# EAGLE design fl5 fl9 modv1 (EAGLE 6.1)
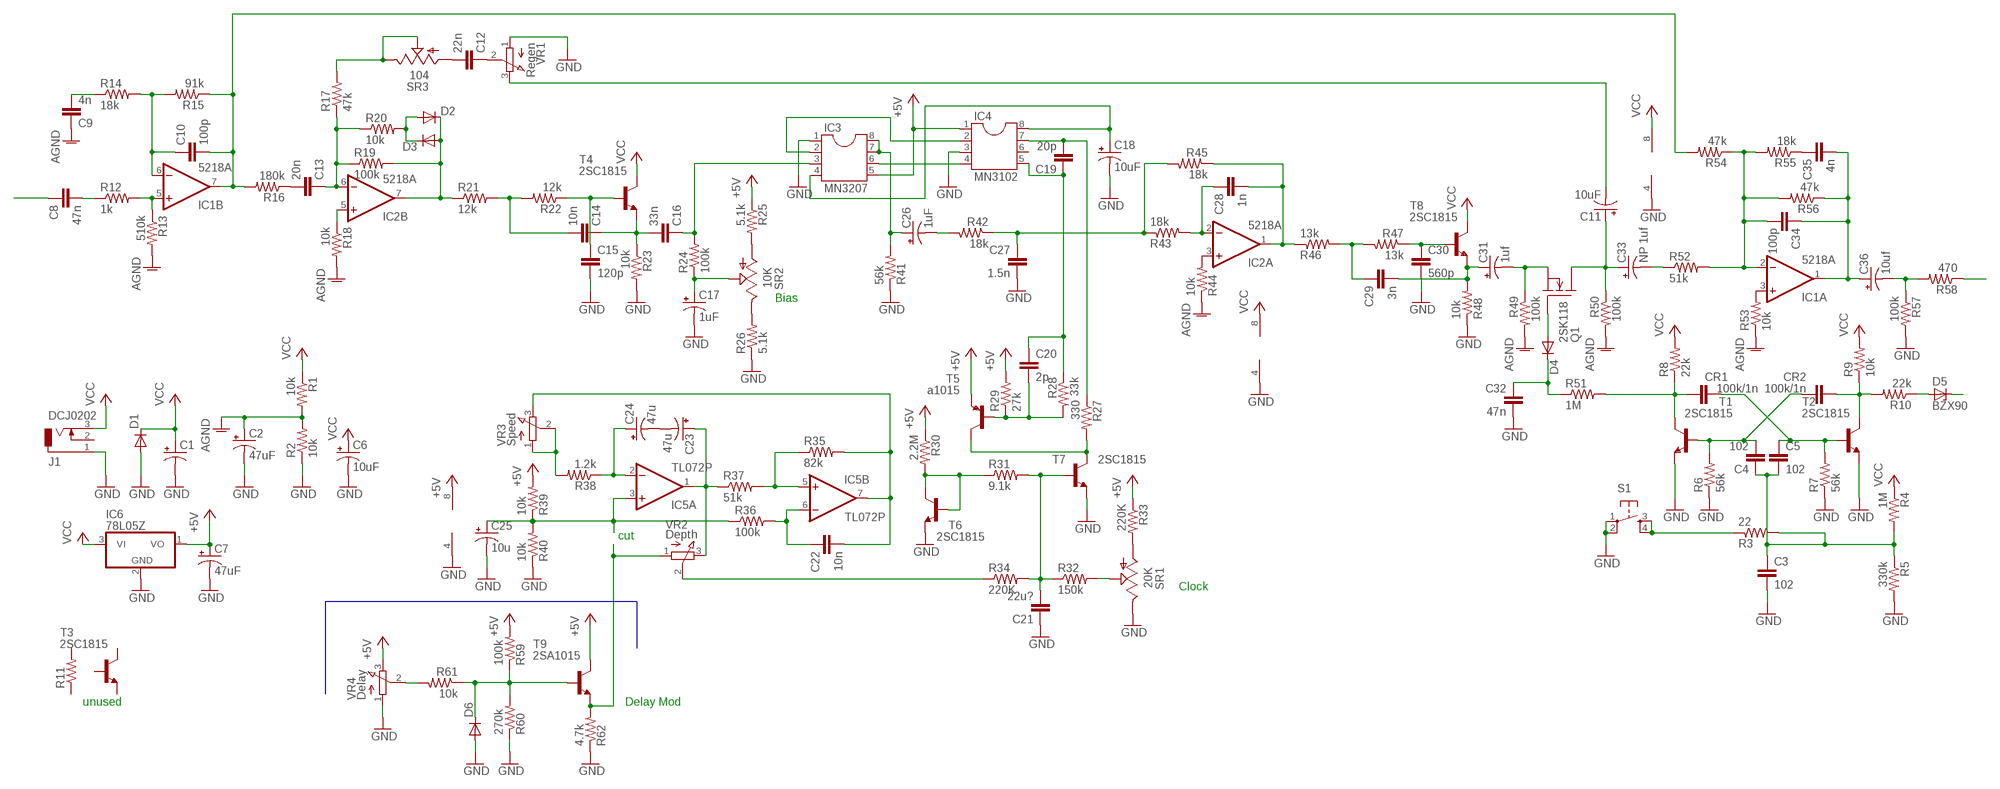
[diagram p0: schematic, sheet 1]

## Parts
C1  CPOL-USE3.5-8  [E3,5-8]
C2  47uF  CPOL-USE1.8-4  [E1,8-4]
C3  102  C-EU025-024X044  [C025-024X044]
C4  102  C-EU025-024X044  [C025-024X044]
C5  102  C-EU025-024X044  [C025-024X044]
C6  10uF  CPOL-USE1.8-4  [E1,8-4]
C7  47uF  CPOL-USE1.8-4  [E1,8-4]
C8  47n  C-EU050-025X075  [C050-025X075]
C9  4n  C-EU050-025X075  [C050-025X075]
C10  100p  C-EU025-024X044  [C025-024X044]
C11  10uF  CPOL-USE1.8-4  [E1,8-4]
C12  22n  C-EU050-025X075  [C050-025X075]
C13  20n  C-EU050-025X075  [C050-025X075]
C14  10n  C-EU050-025X075  [C050-025X075]
C15  120p  C-EU050-024X044  [C050-024X044]
C16  33n  C-EU050-025X075  [C050-025X075]
C17  1uF  CPOL-USE1.8-4  [E1,8-4]
C18  10uF  CPOL-USE1.8-4  [E1,8-4]
C19  20p  C-EU025-024X044  [C025-024X044]
C20  2p  C-EU025-024X044  [C025-024X044]
C21  22u?  C-EU025-024X044  [C025-024X044]
C22  10n  C-EU050-025X075  [C050-025X075]
C23  47u  CPOL-USE2.5-7  [E2,5-7]
C24  47u  CPOL-USE2.5-7  [E2,5-7]
C25  10u  CPOL-USE1.8-4  [E1,8-4]
C26  1uF  CPOL-USE1.8-4  [E1,8-4]
C27  1.5n  C-EU050-025X075  [C050-025X075]
C28  1n  C-EU050-025X075  [C050-025X075]
C29  3n  C-EU050-025X075  [C050-025X075]
C30  560p  C-EU050-024X044  [C050-024X044]
C31  1uf  CPOL-USE1.8-4  [E1,8-4]
C32  47n  C-EU050-025X075  [C050-025X075]
C33  NP 1uf  CPOL-USE1.8-4  [E1,8-4]
C34  100p  C-EU025-024X044  [C025-024X044]
C35  4n  C-EU050-025X075  [C050-025X075]
C36  10uf  CPOL-USE1.8-4  [E1,8-4]
CR1  100k/1n  C-EU025-024X044  [C025-024X044]
CR2  100k/1n  C-EU025-024X044  [C025-024X044]
D1  DIODE-C1702-05  [C1702-05]
D2  DIODE-D-5  [D-5]
D3  DIODE-D-5  [D-5]
D4  DIODE-D-5  [D-5]
D5  BZX90  [DO34Z7]
D6  DIODE-D-5  [D-5]
IC1  5218A  LM4558N  [DIL08]
IC2  5218A  LM4558N  [DIL08]
IC3  MN3207  DIL8  [DIL08]
IC4  MN3102  DIL8  [DIL08]
IC5  TL072P  [DIL08]
IC6  78L05Z  [TO92]
J1  DCJ0202  [DCJ0202]
Q1  2SK118  VN2222KM  [TO237]
R1  10k  R-US_0204/5  [0204/5]
R2  10k  R-US_0204/5  [0204/5]
R3  22  R-US_0204/5  [0204/5]
R4  1M  R-US_0204/5  [0204/5]
R5  330k  R-US_0204/5  [0204/5]
R6  56k  R-US_0204/5  [0204/5]
R7  56k  R-US_0204/5  [0204/5]
R8  22k  R-US_0204/5  [0204/5]
R9  10k  R-US_0204/5  [0204/5]
R10  22k  R-US_0204/5  [0204/5]
R11  R-US_0204/5  [0204/5]
R12  1k  R-US_0204/5  [0204/5]
R13  510k  R-US_0204/5  [0204/5]
R14  18k  R-US_0204/5  [0204/5]
R15  91k  R-US_0204/5  [0204/5]
R16  180k  R-US_0204/5  [0204/5]
R17  47k  R-US_0204/5  [0204/5]
R18  10k  R-US_0204/5  [0204/5]
R19  100k  R-US_0204/5  [0204/5]
R20  10k  R-US_0204/5  [0204/5]
R21  12k  R-US_0204/5  [0204/5]
R22  12k  R-US_0204/5  [0204/5]
R23  10k  R-US_0204/5  [0204/5]
R24  100k  R-US_0204/5  [0204/5]
R25  5.1k  R-US_0204/5  [0204/5]
R26  5.1k  R-US_0204/5  [0204/5]
R27  330  R-US_0204/5  [0204/5]
R28  33k  R-US_0204/5  [0204/5]
R29  27k  R-US_0204/5  [0204/5]
R30  2.2M  R-US_0204/5  [0204/5]
R31  9.1k  R-US_0204/5  [0204/5]
R32  150k  R-US_0204/5  [0204/5]
R33  220K  R-US_0204/5  [0204/5]
R34  220K  R-US_0204/5  [0204/5]
R35  82k  R-US_0204/5  [0204/5]
R36  100k  R-US_0204/5  [0204/5]
R37  51k  R-US_0204/5  [0204/5]
R38  1.2k  R-US_0204/5  [0204/5]
R39  10k  R-US_0204/5  [0204/5]
R40  10k  R-US_0204/5  [0204/5]
R41  56k  R-US_0204/5  [0204/5]
R42  18k  R-US_0204/5  [0204/5]
R43  18k  R-US_0204/5  [0204/5]
R44  10k  R-US_0204/5  [0204/5]
R45  18k  R-US_0204/5  [0204/5]
R46  13k  R-US_0204/5  [0204/5]
R47  13k  R-US_0204/5  [0204/5]
R48  10k  R-US_0204/5  [0204/5]
R49  100k  R-US_0204/5  [0204/5]
R50  100k  R-US_0204/5  [0204/5]
R51  1M  R-US_0204/5  [0204/5]
R52  51k  R-US_0204/5  [0204/5]
R53  10k  R-US_0204/5  [0204/5]
R54  47k  R-US_0204/5  [0204/5]
R55  18k  R-US_0204/5  [0204/5]
R56  47k  R-US_0204/5  [0204/5]
R57  100k  R-US_0204/5  [0204/5]
R58  470  R-US_0204/5  [0204/5]
R59  100k  R-US_0204/5  [0204/5]
R60  270k  R-US_0204/5  [0204/5]
R61  10k  R-US_0204/5  [0204/5]
R62  4.7k  R-US_0204/5  [0204/5]
S1  TAC_SWITCHPTH  [TACTILE-PTH]
SR1  20K  TRIM_US-CA6V  [CA6V]
SR2  10K  TRIM_US-CA6V  [CA6V]
SR3  104  TRIM_US-CA6V  [CA6V]
T1  2SC1815  [TO92-ECB]
T2  2SC1815  [TO92-ECB]
T3  2SC1815  [TO92-ECB]
T4  2SC1815  [TO92-ECB]
T5  a1015  -PNP-TO92-ECB  [TO92-ECB]
T6  2SC1815  [TO92-ECB]
T7  2SC1815  [TO92-ECB]
T8  2SC1815  [TO92-ECB]
T9  2SA1015  2SC1815  [TO92-ECB]
VR1  Regen  EVUF2A  [EVUF]
VR2  Depth  EVUF2A  [EVUF]
VR3  Speed  EVUF2A  [EVUF]
VR4  Delay  EVUF2A  [EVUF]

## Nets
+5V: C7.+ IC3.5 IC4.1 IC5.8(P:V+) IC6.1(VO) R25.1 R29.2 R30.1 R33.1 R39.2 R59.2 T5.E T9.C VR4.3(E)
AGND: C2.+ C9.1 R1.2 R2.2 R13.2 R18.2 R44.1 R49.2 R50.2 R53.1
GND: C1.- C2.- C3.2 C6.- C7.- C15.2 C17.- C18.- C21.1 C25.- C27.2 C30.2 C32.2 D1.A D6.A IC1.4(P:V-) IC2.4(P:V-) IC3.1 IC4.3 IC5.4(P:V-) IC6.2(GND) J1.1 R2.1 R5.2 R6.1 R7.1 R23.2 R26.1 R40.1 R41.1 R48.1 R57.2 R60.1 R62.1 S1.1 S1.2 SR1.E T1.E T2.E T6.E T7.E VR1.1(A) VR4.1(A)
N$1: CR2.1 R9.1 R10.2 T2.C
N$2: C5.1 CR1.1 R7.2 T2.B
N$3: IC1.5(B:+IN) R12.2 R13.1
N$4: C10.2 IC1.7(B:OUT) R15.1 R16.2 R54.2
N$5: C10.1 IC1.6(B:-IN) R14.2 R15.2
N$6: D2.A D3.C R20.2
N$7: D2.C D3.A IC2.7(B:OUT) R19.2 R21.1
N$8: C13.1 IC2.6(B:-IN) R17.1 R19.1 R20.1
N$9: C15.1 R22.1 T4.B
N$10: C3.1 C4.1 C5.2 R3.2 R4.2 R5.1
N$11: R3.1 S1.3 S1.4
N$12: R27.2 T5.C T7.C
N$13: C4.2 CR2.2 R6.2 T1.B
N$14: C12.1 VR1.2(S)
N$15: IC2.5(B:+IN) R18.1
N$16: R30.2 R31.1 T6.B T6.C
N$17: R34.1 VR2.2(S)
N$18: IC2.3(A:+IN) R44.2
N$19: C21.2 R31.2 R32.1 R34.2 T7.B
N$20: C8.2 R12.1
N$21: R32.2 SR1.S
N$22: C12.2 SR3.A
N$23: R33.2 SR1.A
N$24: C20.2 R28.2 R29.1 T5.B
N$25: C23.+ IC5.1(A:OUT) R37.1 VR2.3(E)
N$26: C25.+ IC5.3(A:+IN) R36.1 R39.1 R40.2
N$27: R38.2 VR3.1(A) VR3.2(S)
N$28: C24.+ IC5.2(A:-IN) R38.1
N$29: C22.2 IC5.7(B:OUT) R35.2 VR3.3(E)
N$30: IC5.5(B:+IN) R35.1 R37.2
N$31: C22.1 IC5.6(B:-IN) R36.2
N$32: C28.1 IC2.2(A:-IN) R43.2
N$33: C28.2 IC2.1(A:OUT) R45.1 R46.1
N$34: C29.1 R46.2 R47.2
N$35: R17.2 SR3.E SR3.S
N$36: C13.2 R16.1
N$37: C14.2 R21.2 R22.2
N$38: C14.1 C16.2 R23.1 T4.E
N$39: C9.2 R14.1
N$40: R26.2 SR2.E
N$41: R25.2 SR2.A
N$42: CR1.2 R8.1 R51.2 T1.C
N$43: C32.1 D4.C R51.1
N$44: C17.+ R24.1 SR2.S
N$45: C18.+ IC3.4 IC4.8
N$46: C26.+ IC3.7 IC3.8 R41.2
N$47: C16.1 IC3.3 R24.2
N$48: IC3.2 IC4.2
N$49: C8.1
N$50: IC3.6 IC4.4
N$51: C19.2 IC4.7 R27.1
N$52: C19.1 C20.1 IC4.5 R28.1
N$53: C23.- C24.-
N$54: C26.- R42.2
N$55: C27.1 R42.1 R43.1 R45.2
N$56: C11.+ C33.+ Q1.1(D) R50.1
N$57: C29.2 C31.+ R48.2 T8.E
N$58: C36.- R57.1 R58.2
N$59: C30.1 R47.1 T8.B
N$60: D4.A Q1.2(G)
N$61: C33.- R52.1
N$62: C11.- VR1.3(E)
N$63: C31.- Q1.3(S) R49.1
N$64: C34.1 C35.2 C36.+ IC1.1(A:OUT) R56.1
N$65: IC1.3(A:+IN) R53.2
N$66: C34.2 IC1.2(A:-IN) R52.2 R54.1 R55.2 R56.2
N$67: C35.1 R55.1
N$68: D5.A R10.1
N$69: R58.1
N$70: D5.C
N$71: R62.2 T9.E VR2.1(A)
N$72: D6.C R59.1 R60.2 R61.1 T9.B
N$74: R61.2 VR4.2(S)
VCC: C1.+ C6.+ D1.C IC1.8(P:V+) IC2.8(P:V+) IC6.3(VI) J1.3 R1.1 R4.1 R8.2 R9.2 T4.C T8.C
Unconnected: IC4.6 J1.2 R11.1 R11.2 T3.B T3.C T3.E

## Buses
B$1

## Notes on the sheet
- Bias
- cut
- Clock
- unused | Delay Mod

## Library data of the parts
C1 C2 C6 C7 C11 C17 C18 C23-C26 C31 C33 C36 = rcl:CPOL-US: POLARIZED CAPACITOR, American symbol
C3-C5 C8-C10 C12-C16 C19-C22 C27-C30 C32 C34 C35 CR1 CR2 = rcl:C-EU: CAPACITOR, European symbol
D1-D4 D6 = diode:DIODE-: DIODE
D5 = diode:BZX90: Z DIODE
IC1 IC2 = linear:*4558: OP AMP
IC3 IC4 = ic-package:DIL8: Dual In Line / Socket
IC5 = linear:TL072: OP AMP
IC6 = linear:78*: Positive VOLTAGE REGULATOR Source: http://cache.national.com/ds/LM/LM78L05.pdf http://www.fairchildsemi.com/ds/LM/LM7805.pdf
J1 = con-jack:DCJ0202: DC POWER JACK Source: DCJ0202.pdf; OC_FARNELL: unknown; OC_NEWARK: unknown
Q1 = transistor-fet:VN2222KM: N-Channel Enhancement MOSFET (VMOS); 60V; 0,5A; 7,5Ohm
R1-R62 = rcl:R-US_: RESISTOR, American symbol
S1 = SparkFun:TAC_SWITCH: Momentary Switch Button commonly used for reset or general input. Spark Fun Electronics SKU : COM-00097
SR1-SR3 = pot:TRIM_US-: POTENTIOMETER
T1-T4 T6-T9 = transistor:2SC1815: NPN EPITAXIAL TRANSISTOR Source: TOSHIBA .. 2SC1815 1.pdf
T5 = transistor-neu-to92:*-PNP-: PNP Transistror
VR1-VR4 = pot:EVU: 9 mm Square Rotary Potentiometers Source: Panasonic

## Board
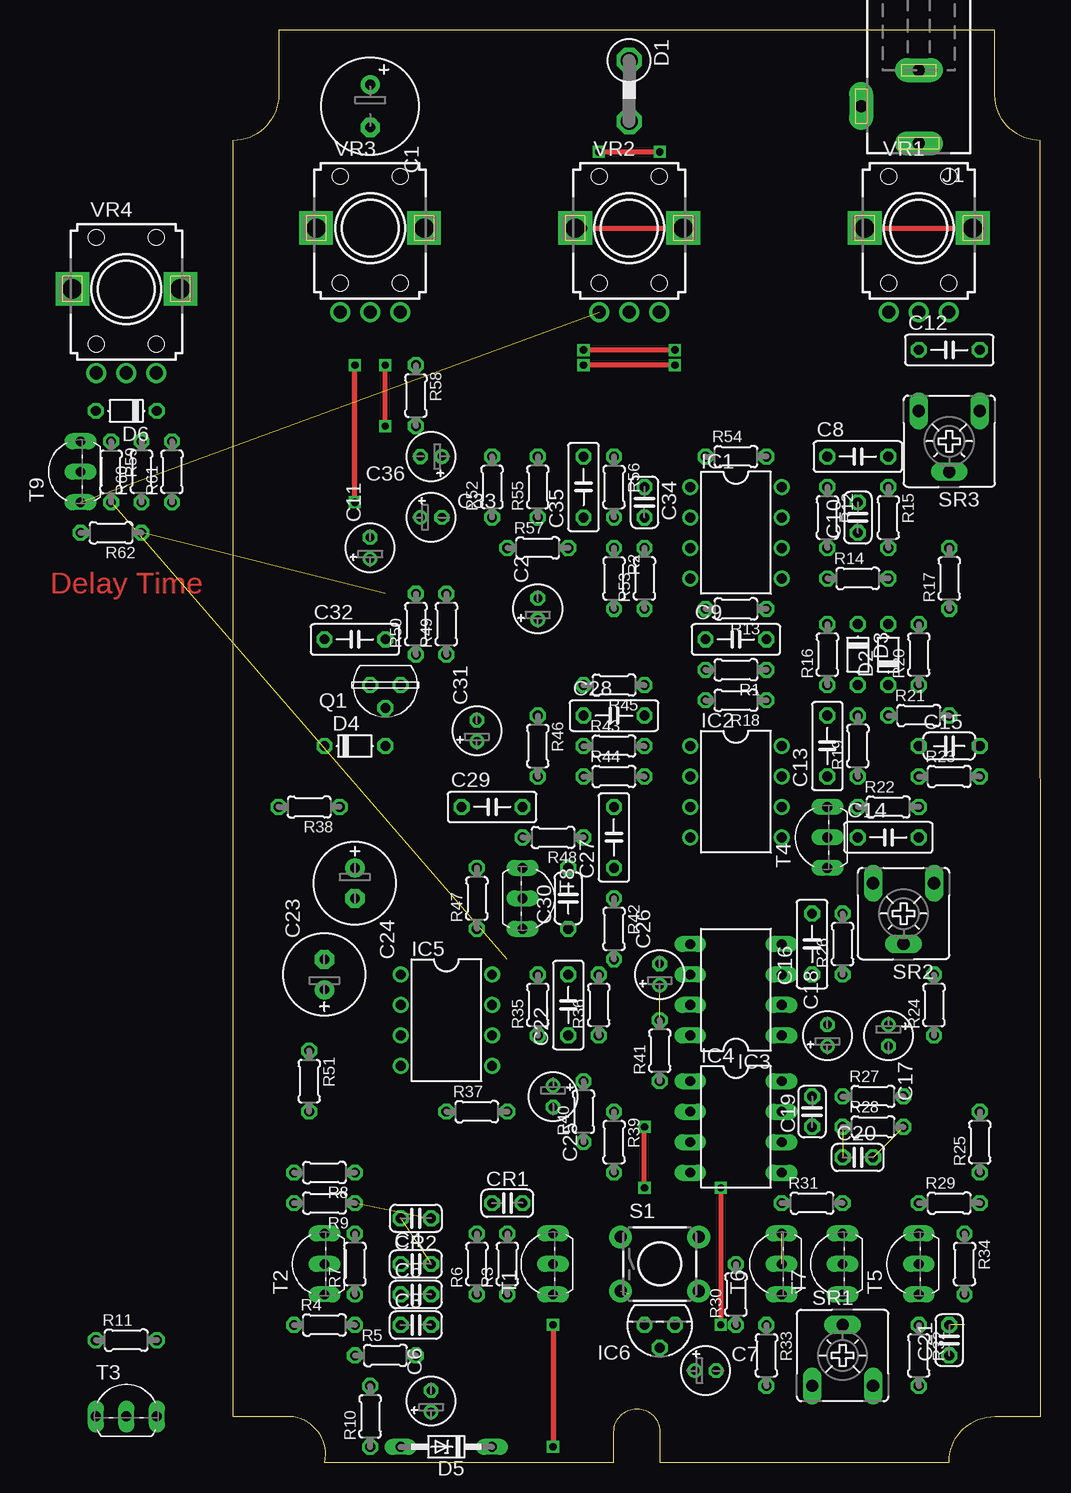
[diagram p1: board, top side]
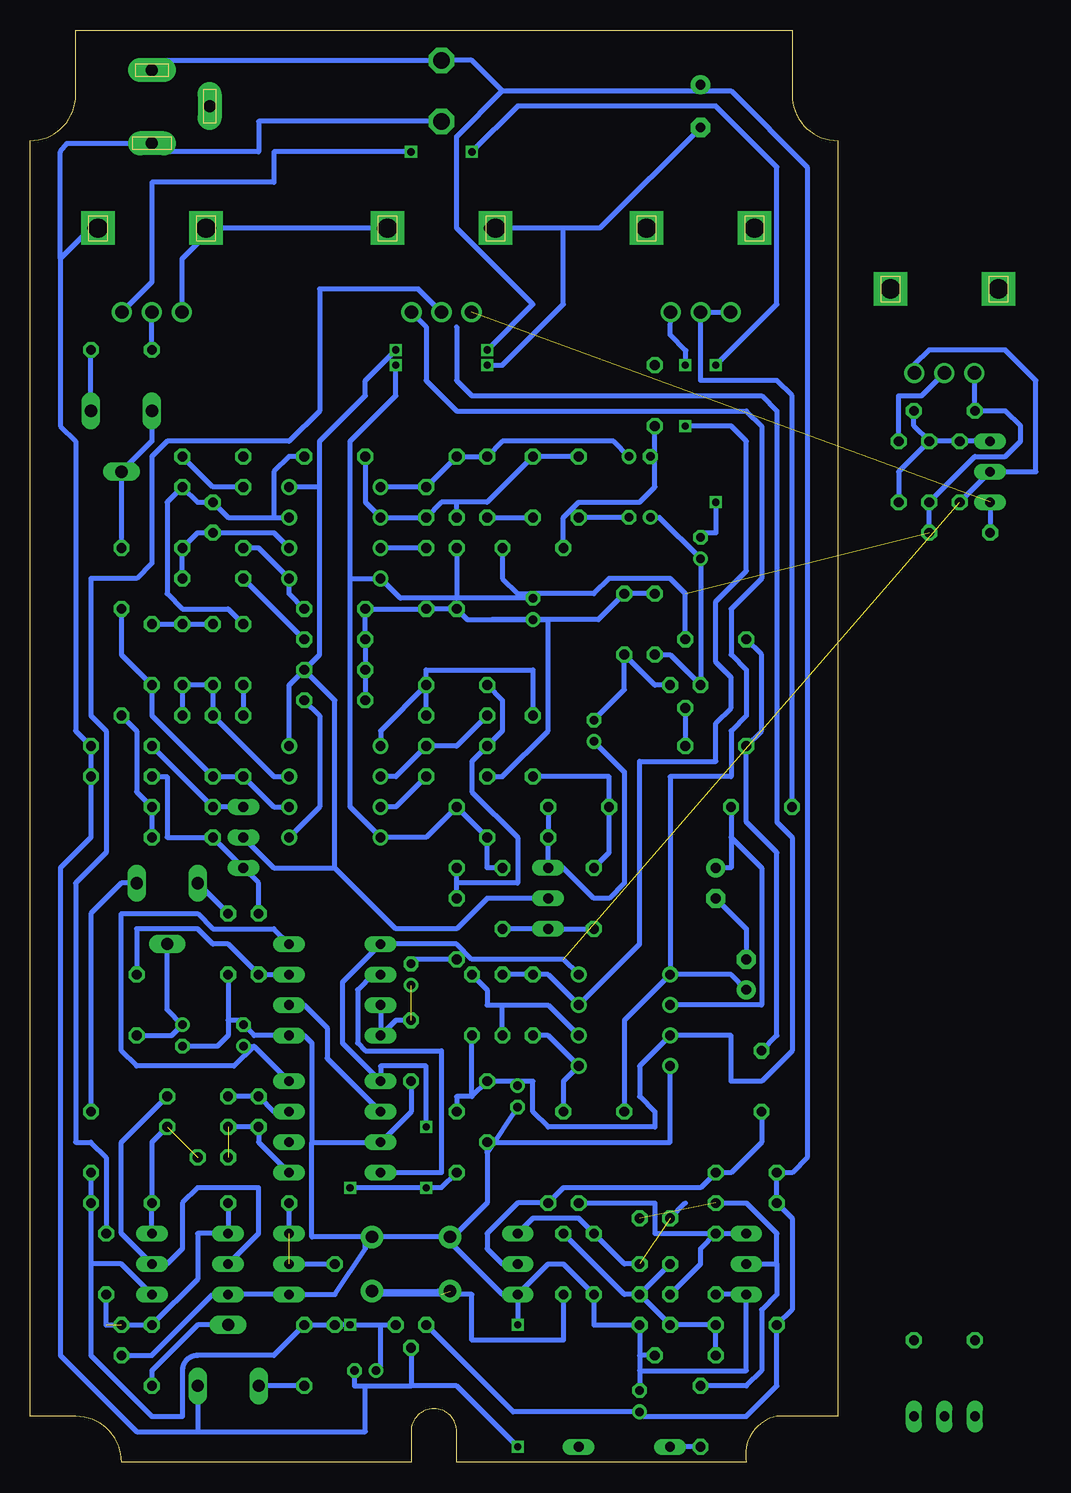
[diagram p2: board, bottom side, seen from below]

Size 67.31 x 119.38 mm. Coordinates in mm from the lower left corner, seen from the top.
Outline: 7.62,0 31.75,0 31.75,2.54 arc-180 35.56,2.54 35.56,0 59.67,0 arc-90 63.48,3.81 67.31,3.81 67.29,110.16 arc-90 63.5,113.95 63.5,119.38 3.81,119.38 3.81,113.97 arc-90 0,110.16 0,3.81 5.08,3.81 arc-90 7.62,0
Copper layers (1*16): Top 0.035mm / dielectric 1.5mm / Bottom 0.035mm
Design rules: minimum track width 10mil, minimum drill 24mil, track to track 8mil, track to pad 8mil, pad to pad 8mil, via to via 8mil, smd to smd 8mil, copper to edge 40mil, drill to drill 8mil, minimum pad ring 10mil, minimum via ring 8mil, stop-mask expansion 4mil, vias tented up to drill 0mil, thermal gap 10mil

### Footprints (pad centres in the part's own frame; a part is rotated, then mirrored left to right if it is on the bottom)
E3,5-8 = drill 0.813 pad 1.6: + -1.778,0 | drill 0.813 pad 1.6 octagon: - 1.778,0
E1,8-4 = drill 0.711 pad 1.168: + -0.889,0 | drill 0.711 pad 1.168 octagon: - 0.889,0
C025-024X044 = drill 0.813 octagon: 1 -1.27,0; 2 1.27,0
C050-025X075 = drill 0.813 octagon: 1 -2.54,0; 2 2.54,0
C050-024X044 = drill 0.813 octagon: 1 -2.54,0; 2 2.54,0
E2,5-7 = drill 0.813 pad 1.6: + -1.27,0 | drill 0.813 pad 1.6 octagon: - 1.27,0
C1702-05 = drill 1.397 octagon: A 2.54,0; C -2.54,0
D-5 = drill 0.813 octagon: A 2.54,0; C -2.54,0
DO34Z7 = drill 0.813 long: A 3.81,0; C -3.81,0
DIL08 = drill 0.813 pad 1.27: 1 -3.81,-3.81; 2 -1.27,-3.81; 3 1.27,-3.81; 4 3.81,-3.81; 5 3.81,3.81; 6 1.27,3.81; 7 -1.27,3.81; 8 -3.81,3.81
DIL08' = drill 0.813 long: 1 -3.81,-3.81; 2 -1.27,-3.81; 3 1.27,-3.81; 4 3.81,-3.81; 5 3.81,3.81; 6 1.27,3.81; 7 -1.27,3.81; 8 -3.81,3.81
TO92 = drill 0.813 octagon: 1 -1.27,0; 2 0,1.905; 3 1.27,0
DCJ0202 = drill 1 pad 2 long: 1 0,3.1; 2 4.8,0; 3 0,-3
TO237 = drill 0.813 octagon: 1 1.27,0; 2 0,1.905; 3 -1.27,0
0204/5 = drill 0.813 octagon: 1 -2.54,0; 2 2.54,0
TACTILE-PTH = drill 1.016 pad 1.88: 1 -3.251,2.261; 2 3.251,2.261; 3 -3.251,-2.261; 4 3.251,-2.261
CA6V = drill 1.016 long: A -2.54,-2.54; E 2.54,-2.54; S 0,2.54
TO92-ECB = drill 0.813 long: B 2.54,0; C 0,0; E -2.54,0
EVUF = drill 1.1 pad 1.676: 1 -2.5,-7; 2 0,-7; 3 2.5,-7 | drill 1.6 pad 2.8 square: M1 4.5,0; M2 -4.5,0

### Placement (x,y rotation side)
C1  11.43,113.03 270 top
C2  25.4,71.12 90 top
C3  15.24,11.43 0 top
C4  15.24,16.51 0 top
C5  15.24,13.97 0 top
C6  16.51,5.08 90 top
C7  39.37,7.62 0 top
C8  52.07,83.82 0 top
C9  41.91,68.58 0 top
C10  52.07,78.74 90 top
C11  11.43,76.2 90 top
C12  59.69,92.71 0 top
C13  49.53,59.69 90 top
C14  54.61,52.07 0 top
C15  59.69,59.69 0 top
C16  48.26,43.18 90 top
C17  54.61,35.56 270 top
C18  49.53,35.56 90 top
C19  48.26,29.21 90 top
C20  52.07,25.4 0 top
C21  59.69,10.16 90 top
C22  27.94,38.1 90 top
C23  7.62,40.64 90 top
C24  10.16,48.26 270 top
C25  26.67,30.48 270 top
C26  35.56,40.64 90 top
C27  31.75,52.07 90 top
C28  31.75,62.23 0 top
C29  21.59,54.61 0 top
C30  27.94,46.99 90 top
C31  20.32,60.96 90 top
C32  10.16,68.58 0 top
C33  16.51,78.74 0 top
C34  34.29,80.01 270 top
C35  29.21,81.28 90 top
C36  16.51,83.82 180 top
CR1  22.86,21.59 0 top
CR2  15.24,20.32 180 top
D1  33.02,114.3 270 top
D2  54.61,67.31 90 top
D3  52.07,67.31 270 top
D4  10.16,59.69 0 top
D5  17.78,1.27 180 top
D6  -8.89,87.63 180 top  (outside the outline)
IC1  41.91,77.47 270 top
IC2  41.91,55.88 270 top
IC3  MN3207  [DIL08']  41.91,39.37 90 top
IC4  MN3102  [DIL08']  41.91,27.94 270 top
IC5  17.78,36.83 270 top
IC6  35.56,11.43 180 top
J1  57.15,113.03 180 top
Q1  12.7,64.77 180 top
R1  41.91,66.04 180 top
R2  31.75,73.66 270 top
R3  22.86,16.51 90 top
R4  7.62,11.43 0 top
R5  12.7,8.89 0 top
R6  20.32,16.51 90 top
R7  10.16,16.51 90 top
R8  7.62,24.13 180 top
R9  7.62,21.59 180 top
R10  11.43,3.81 90 top
R11  -8.89,10.16 0 top  (outside the outline)
R12  49.53,78.74 270 top
R13  41.91,71.12 180 top
R14  52.07,73.66 0 top
R15  54.61,78.74 270 top
R16  49.53,67.31 90 top
R17  59.69,73.66 90 top
R18  41.91,63.5 180 top
R19  52.07,59.69 90 top
R20  57.15,67.31 90 top
R21  57.15,62.23 0 top
R22  54.61,54.61 0 top
R23  59.69,57.15 0 top
R24  58.42,38.1 90 top
R25  62.23,26.67 90 top
R26  50.8,43.18 90 top
R27  53.34,30.48 0 top
R28  53.34,27.94 0 top
R29  59.69,21.59 0 top
R30  41.91,13.97 90 top
R31  48.26,21.59 0 top
R32  57.15,8.89 270 top
R33  44.45,8.89 270 top
R34  60.96,16.51 270 top
R35  25.4,38.1 90 top
R36  30.48,38.1 90 top
R37  20.32,29.21 0 top
R38  6.35,54.61 180 top
R39  31.75,26.67 270 top
R40  29.21,29.21 90 top
R41  35.56,34.29 90 top
R42  31.75,44.45 270 top
R43  31.75,59.69 0 top
R44  31.75,57.15 0 top
R45  31.75,64.77 180 top
R46  25.4,59.69 270 top
R47  20.32,46.99 90 top
R48  26.67,52.07 180 top
R49  17.78,69.85 90 top
R50  15.24,69.85 90 top
R51  6.35,31.75 270 top
R52  21.59,81.28 90 top
R53  34.29,73.66 90 top
R54  41.91,83.82 0 top
R55  25.4,81.28 90 top
R56  31.75,81.28 270 top
R57  25.4,76.2 0 top
R58  15.24,88.9 270 top
R59  -10.16,82.55 270 top  (outside the outline)
R60  -7.62,82.55 90 top  (outside the outline)
R61  -5.08,82.55 90 top  (outside the outline)
R62  -10.16,77.47 180 top  (outside the outline)
S1  35.56,16.51 0 top
SR1  50.8,8.89 0 top
SR2  55.88,45.72 180 top
SR3  59.69,85.09 180 top
T1  26.67,16.51 90 top
T2  7.62,16.51 90 top
T3  -8.89,3.81 0 top  (outside the outline)
T4  49.53,52.07 90 top
T5  57.15,16.51 90 top
T6  45.72,16.51 90 top
T7  50.8,16.51 90 top
T8  24.13,46.99 270 top
T9  -12.7,82.55 90 top  (outside the outline)
VR1  57.15,102.87 0 top
VR2  33.02,102.87 0 top
VR3  11.43,102.87 0 top
VR4  -8.89,97.79 0 top  (outside the outline)

### Tracks (layer width: path | path; a pad name or v marks a point on that pad's centre or on a via)
+5V  (via drill 0.6)  (1 unrouted)
  Top 0.406: v34.29,22.86 v34.29,27.94 | v40.64,22.86 v40.64,11.43
  Bottom 0.406: R25.1 R29.2 62.23,16.51 | 62.23,16.51 62.23,8.89 57.15,3.81 54.61,3.81 54.61,7.62 arc90 53.34,8.89 46.99,8.89 R33.1 R30.1 v40.64,11.43 38.1,11.43 | T5.E 59.69,16.51 62.23,16.51 | R39.2 33.02,22.86 v34.29,22.86 v40.64,22.86 | v34.29,27.94 34.29,33.02 38.1,33.02 IC4.1 41.27,34.92 41.27,40.01 IC3.5 31.75,43.18 30.48,41.91 22.86,41.91 IC5.8 | 38.1,11.43 IC6.1 | C7.+ 38.1,8 38.1,11.43 | R59.2 T9.C -16.51,82.55 -16.51,90.17 -13.97,92.71 -7.62,92.71 -6.39,91.48 VR4.3
AGND
  Bottom 0.406: R50.2 R49.2 19.94,70.23 C2.+ | C2.+ 24.13,70.23 24.13,60.96 27.94,57.15 R44.1 | C2.+ 28.83,70.23 | R18.2 R1.2 C9.1 R13.2 R53.1 R2.2 30.86,70.23 C2.+
GND  (via drill 0.6)  (1 unrouted)
  Top 0.406: v26.67,11.43 v26.67,1.27 | v36.83,91.44 v29.21,91.44 | v29.21,102.87 v38.1,102.87 | v52.07,102.87 v62.23,102.87
  Bottom 0.406: 16.51,8.89 16.51,7.62 | 16.51,7.62 C6.- | 16.51,8.89 C3.2 20.32,11.43 R6.1 22.86,16.51 24.13,16.51 T1.E | 16.51,7.62 7.62,7.62 T2.E R7.1 | T1.E v26.67,11.43 | IC6.2 35.56,6.35 | C7.- 40.26,6.35 39.37,6.35 | 32.74,18.77 S1.1 32.03,19.05 31.75,19.05 29.21,21.59 R40.1 | 32.74,18.77 S1.2 | T1.E 27.94,13.97 32.74,18.77 | S1.2 39.37,18.21 39.37,17.78 41.91,13.97 T6.E T7.E 52.07,13.97 57.15,8.89 C21.1 | SR1.E 53.34,2.54 | 53.34,2.54 39.37,2.54 39.37,6.35 | R40.1 13.97,26.67 IC5.4 | R5.2 16.51,8.89 | 31.75,72.01 C2.- 25.4,72.39 | 31.75,72.01 36.45,72.01 IC1.4 40.64,73.66 | 53.34,2.54 58.42,2.54 64.77,8.89 64.77,49.53 62.23,52.07 R23.2 C15.2 63.5,60.96 63.5,85.09 64.77,86.36 64.77,100.33 | R26.1 50.8,36.83 | 50.8,36.83 50.8,35.56 51.69,34.67 C17.- | 50.8,36.83 49.91,36.83 C18.- 48.64,35.56 IC3.1 44.45,35.56 43.81,34.92 43.81,26.67 | 43.81,26.67 IC4.3 35.56,29.21 R41.1 | S1.2 43.81,18.77 43.81,26.67 | 40.64,73.66 40.64,54.61 IC2.4 34.29,52.07 C27.2 R48.1 29.21,49.53 C30.2 | VR1.1 54.65,100.29 v52.07,102.87 v38.1,102.87 | 40.64,73.66 40.64,85.09 36.83,88.9 v36.83,91.44 | v29.21,91.44 27.94,91.44 22.86,96.52 22.86,102.87 | 22.86,102.87 v29.21,102.87 | v62.23,102.87 64.77,100.33 | v26.67,1.27 31.75,6.35 35.56,6.35 | 39.37,6.35 35.56,6.35 | C25.- 29.21,25.78 R40.1 | C32.2 12.7,72.39 13.97,73.66 19.05,73.66 20.32,72.39 25.4,72.39 | R57.2 27.94,73.66 26.67,72.39 25.4,72.39 | R2.1 31.75,72.01 | C1.- 19.81,102.87 22.86,102.87 | 64.77,100.33 64.77,109.22 64.21,109.93 J1.1 57.15,109.22 48.26,109.22 48.26,111.76 D1.A | R62.1 R60.1 -11.43,83.82 -13.97,83.82 -15.24,85.09 -15.24,86.36 -13.97,87.63 D6.A -11.43,90.75 VR4.1
N$1  (1 unrouted)
  Bottom 0.406: R9.1 7.62,21.59 5.08,19.05 5.08,16.51 | T2.C 5.08,16.51 | 5.08,16.51 5.08,13.97 6.35,12.7 6.35,7.62 7.62,6.35 R10.2
N$2
  Bottom 0.406: C5.1 11.43,16.51 11.43,17.78 R7.2 | R7.2 T2.B | CR1.1 15.24,21.59 15.24,19.05 R7.2
N$3
  Bottom 0.406: R12.2 48.26,76.2 IC1.5 45.72,72.39 R13.1
N$4
  Bottom 0.406: R16.2 50.8,71.12 54.61,71.12 55.88,72.39 55.88,80.01 R15.1 53.34,80.01 C10.2 50.8,78.74 46.99,78.74 | 46.99,78.74 IC1.7 | R54.2 45.72,83.82 46.99,82.55 46.99,78.74
N$5
  Bottom 0.406: R14.2 R15.2 53.34,77.47 C10.1 46.99,77.47 IC1.6
N$6
  Bottom 0.406: R20.2 D2.A D3.C
N$7
  Bottom 0.406: R21.1 D2.C D3.A R19.2 46.99,57.15 IC2.7
N$8
  Bottom 0.406: IC2.6 46.99,54.61 C13.1 R19.1 57.15,62.23 R20.1 59.69,67.31 R17.1
N$9
  Bottom 0.406: T4.B R22.1 C15.1
N$10
  Bottom 0.406: R5.1 R4.2 C3.1 C5.2 | C5.2 C4.1 | C5.2 17.78,13.97 R3.2
N$11  (1 unrouted)
  Bottom 0.406: R3.1 22.86,10.16 30.48,10.16 30.48,13.97 33.02,13.97 | 33.02,13.97 38.1,13.97 | S1.4 33.3,14.25 33.02,13.97
N$12
  Bottom 0.406: T7.C 48.26,19.05 48.26,22.86 53.34,22.86 54.61,21.59 54.61,17.78 55.88,16.51 T5.C 59.69,19.05 59.69,26.67 R27.2
N$13  (1 unrouted)
  Bottom 0.406: C4.2 17.78,16.51 R6.2 21.59,20.32 25.4,20.32 T1.B | CR2.2 12.7,21.59
N$14
  Bottom 0.406: C12.1 VR1.2
N$15
  Bottom 0.406: R18.1 43.18,62.23 43.18,54.61 IC2.5
N$16  (1 unrouted)
  Bottom 0.406: T6.C R30.2 | T6.B R31.1
N$17
  Bottom 0.406: VR2.2 34.94,97.79 43.18,97.79 43.18,87.63 45.72,85.09 55.88,85.09 57.15,83.82 57.15,74.93 58.42,73.66 62.23,73.66 62.23,62.23 60.96,60.96 60.96,50.8 63.5,48.26 63.5,26.67 62.23,26.67 60.96,25.4 R34.1
N$18
  Bottom 0.406: R44.2 36.83,54.61 IC2.3
N$19  (1 unrouted)
  Bottom 0.406: R31.2 T7.B 53.34,19.05 53.34,15.24 R32.1 60.96,11.43 R34.2
N$20
  Bottom 0.406: R12.1 52.07,81.28 C8.2
N$21
  Bottom 0.406: SR1.S 53.34,11.43 57.15,7.62 R32.2
N$22
  Bottom 0.406: SR3.A C12.2
N$23
  Bottom 0.406: R33.2 SR1.A
N$24  (1 unrouted)
  Bottom 0.406: T5.B R29.1 57.15,26.67 R28.2
N$25
  Bottom 0.406: VR2.3 34.29,94.64 34.29,90.17 31.75,87.63 7.62,87.63 6.35,86.36 6.35,73.66 8.89,71.12 8.89,67.31 7.62,66.04 7.62,62.23 8.89,60.96 8.89,57.15 13.97,57.15 IC5.1 | IC5.1 17.78,36.83 R37.1 | C23.+ 8.89,40.64 IC5.1
N$26
  Bottom 0.406: 31.75,94.64 31.75,90.17 30.48,88.9 6.35,88.9 5.08,87.63 5.08,53.34 3.81,52.07 3.81,34.29 6.35,31.75 8.89,31.75 8.89,35.56 IC5.3 16.51,33.02 16.51,30.48 15.24,29.21 15.24,27.94 24.13,27.94 25.4,29.21 25.4,31.75 26.67,31.75 | 26.67,31.75 R40.2 30.48,30.48 | 30.48,30.48 R36.1 | 30.48,30.48 31.75,30.48 R39.1 | C25.+ 26.67,31.75
N$27
  Bottom 0.406: R38.2 3.81,88.9 5.08,90.17 11.43,90.17 VR3.2 | 11.45,95.87 VR3.2 | VR3.2 VR3.1
N$28
  Bottom 0.406: R38.1 8.89,52.07 | 8.89,52.07 6.35,49.53 6.35,38.1 IC5.2 | 8.89,52.07 8.89,49.53 C24.+
N$29  (via drill 0.6)
  Top 0.406: v12.7,86.36 v12.7,91.44
  Bottom 0.406: v12.7,86.36 8.89,86.36 7.62,85.09 7.62,74.3 10.16,71.75 10.16,66.67 8.89,65.41 8.89,62.87 10.16,61.59 10.16,58.42 16.51,58.42 16.51,43.18 IC5.7 24.13,40.64 R35.2 C22.2 | v12.7,91.44 12.66,91.48 12.66,92.67 13.97,93.98 VR3.3
N$30
  Bottom 0.406: R35.1 24.13,35.56 IC5.5 22.86,31.75 R37.2
N$31
  Bottom 0.406: R36.2 29.21,39.37 29.21,38.1 27.94,38.1 | 27.94,38.1 24.13,38.1 IC5.6 | C22.1 27.94,38.1
N$32
  Bottom 0.406: IC2.2 36.83,57.15 R43.2 31.75,59.69 C28.1
N$33
  Bottom 0.406: R45.1 34.29,66.04 25.4,66.04 R46.1 | R45.1 38.1,60.96 IC2.1 | C28.2 R45.1
N$34
  Bottom 0.406: R47.2 19.05,50.8 C29.1 19.05,57.15 R46.2
N$35
  Bottom 0.406: SR3.E 57.15,85.09 SR3.S R17.2
N$36
  Bottom 0.406: R16.1 C13.2
N$37
  Bottom 0.406: C14.2 R22.2 58.42,55.88 58.42,60.96 R21.2
N$38
  Bottom 0.406: R23.1 55.88,57.15 55.88,52.07 C14.1 T4.E 48.26,48.26 C16.2
N$39
  Bottom 0.406: C9.2 R14.1
N$40
  Bottom 0.406: R26.2 SR2.E
N$41
  Bottom 0.406: SR2.A 59.69,48.26 62.23,45.72 R25.2
N$42
  Bottom 0.406: R51.2 6.35,26.67 8.89,24.13 R8.1 11.43,22.86 22.86,22.86 CR1.2 26.67,21.59 29.21,19.05 29.21,17.78 27.94,16.51 T1.C
N$43
  Bottom 0.406: R51.1 5.08,35.56 5.08,50.8 7.62,53.34 D4.C 6.35,60.96 6.35,67.31 C32.1
N$44
  Bottom 0.406: R24.1 55.5,35.56 C17.+ 55.88,37.72 SR2.S
N$45
  Bottom 0.406: C18.+ 48.64,34.67 | 48.64,34.67 IC4.8 | 48.64,34.67 50.29,33.02 58.42,33.02 59.69,34.29 59.69,45.72 53.34,45.72 52.07,44.45 46.99,44.45 IC3.4
N$46  (1 unrouted)
  Bottom 0.406: R41.2 36.83,36.83 IC3.8 IC3.7
N$47
  Bottom 0.406: R24.2 58.42,44.45 53.34,44.45 52.07,43.18 50.8,43.18 C16.1 IC3.3
N$48
  Bottom 0.406: IC3.2 44.45,38.1 42.54,36.2 42.54,33.66 IC4.2
N$50
  Bottom 0.406: IC3.6 38.73,40.64 40,39.37 40,34.92 39.37,34.29 33.02,34.29 33.02,24.13 IC4.4
N$51
  Bottom 0.406: IC4.7 46.99,29.21 C19.2 R27.1
N$52  (1 unrouted)
  Bottom 0.406: IC4.5 48.26,26.67 C19.1 R28.1
N$53
  Bottom 0.406: C24.- 7.62,44.45 C23.-
N$54
  Bottom 0.406: R42.2 35.56,41.91 C26.-
N$55
  Bottom 0.406: R42.1 31.75,48.26 | 31.75,48.26 C27.1 | R45.2 27.94,63.5 27.94,60.96 R43.1 30.48,58.42 30.48,55.88 26.67,52.07 26.67,48.26 31.75,48.26
N$56
  Bottom 0.406: R50.1 13.97,67.31 Q1.1 C11.+ 14.86,78.74 C33.+
N$57
  Bottom 0.406: C29.2 R48.2 T8.E 22.86,49.53 20.32,46.99 19.05,46.99 17.78,48.26 17.78,57.53 C31.+
N$58
  Bottom 0.406: R57.1 22.86,78.74 21.59,80.01 16.51,80.01 15.24,81.28 15.24,83.82 | 15.24,83.82 R58.2 | C36.- 15.24,83.82
N$59
  Bottom 0.406: C30.1 T8.B R47.1
N$60
  Bottom 0.406: Q1.2 D4.A
N$61
  Bottom 0.406: C33.- R52.1
N$62  (via drill 0.6)
  Top 0.406: v10.16,80.01 v10.16,91.44 | v30.48,109.22 v35.56,109.22
  Bottom 0.406: v10.16,91.44 5.08,96.52 5.08,107.95 10.16,113.03 26.67,113.03 v30.48,109.22 | v35.56,109.22 46.99,109.22 46.99,106.68 57.15,106.68 57.15,98.37 VR1.3 | v10.16,80.01 10.16,77.47 11.05,77.47 C11.-
N$63
  Bottom 0.406: Q1.3 15.24,64.77 R49.1 17.78,64.39 C31.-
N$64
  Bottom 0.406: IC1.1 C34.1 R56.1 C35.2 27.94,85.09 18.67,85.09 C36.+
N$65
  Bottom 0.406: R53.2 IC1.3
N$66
  Bottom 0.406: R52.2 R55.2 29.21,80.01 31.75,80.01 | R54.1 39.37,80.01 IC1.2 C34.2 33.02,80.01 31.75,80.01 | R56.2 31.75,80.01
N$67
  Bottom 0.406: C35.1 R55.1
N$68
  Bottom 0.406: R10.1 D5.A
N$71  (1 unrouted)
  Bottom 0.406: T9.E R62.2
N$72
  Bottom 0.406: T9.B R59.1 R60.2 | R60.2 -6.35,86.36 D6.C | R60.2 -5.08,82.55 R61.1
N$74
  Bottom 0.406: R61.2 -5.08,88.9 -7,88.9 VR4.2
VCC  (via drill 0.6)
  Top 0.406: v36.83,92.71 v29.21,92.71
  Bottom 0.406: IC6.3 27.05,4.19 C6.+ 16.13,3.81 7.62,3.81 5.08,6.35 R4.1 3.81,12.7 3.81,20.32 R9.2 R8.2 3.81,24.13 2.54,25.4 2.54,107.95 8.89,114.3 11.43,114.3 | IC2.8 45.72,64.77 R1.1 | 43.18,81.28 43.18,67.31 R1.1 | 43.18,81.28 IC1.8 | T4.C 46.99,49.53 41.91,49.53 | 41.91,49.53 41.91,63.5 R1.1 | 43.18,81.28 43.18,85.09 39.37,88.9 39.37,90.17 v36.83,92.71 | v29.21,92.71 25.4,96.52 31.75,102.87 31.75,110.49 27.94,114.3 | 27.94,114.3 11.43,114.3 | T8.C 29.21,46.99 31.75,44.45 36.83,44.45 41.91,49.53 | C1.+ 11.43,114.3 | 27.94,114.3 30.48,116.84 D1.C 56.34,116.84 J1.3

### Text on the board
Top: Delay Time